# EAGLE design ICSP_Pogo_Connector (EAGLE 6.4)
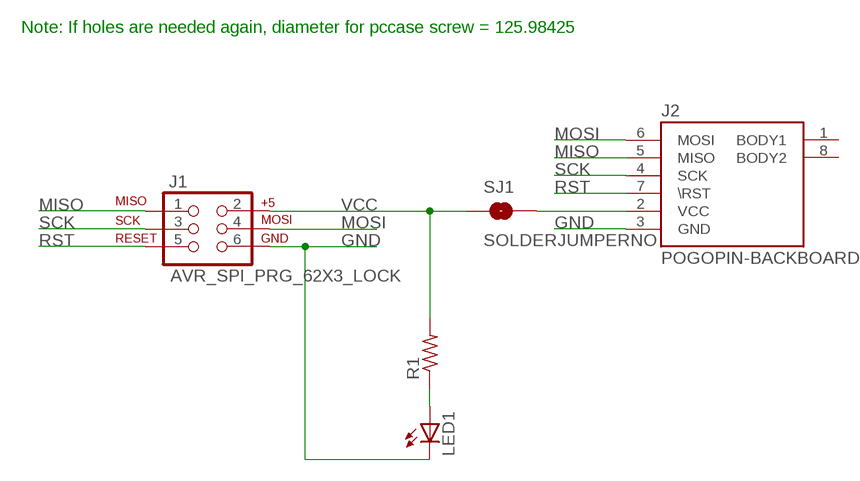
[diagram p0: schematic, sheet 1]

## Parts
J1  AVR_SPI_PRG_62X3_LOCK  [2X3_LOCK]
J2  POGOPIN-BACKBOARD  [POGOPROG-BACKMOUNT]
LED1  LED0603  [LED-0603]
R1  R-US_R0603  [R0603]
SJ1  SOLDERJUMPERNO  [SJ_2S-NO]

## Nets
GND [POWER]: J1.6 J2.3(GND) LED1.C
MISO: J1.1 J2.5(MISO)
MOSI: J1.4 J2.6(MOSI)
N$2: J2.2(VCC) SJ1.2
N$3: LED1.A R1.1
RST: J1.5 J2.7(\RST)
SCK: J1.3 J2.4(SCK)
VCC: J1.2 R1.2 SJ1.1
Unconnected: J2.1(BODY1) J2.8(BODY2)

## Notes on the sheet
- Note: If holes are needed again, diameter for pccase screw = 125.98425

## Library data of the parts
J1 = SparkFun:AVR_SPI_PRG_6: AVR ISP 6 Pin This is the reduced ISP connector for AVR programming. Common on Arduino. This footprint will take up less PCB space and can be used with a 10-pin to 6-pin adapter such as SKU: BOB-08508
J2 = Protofusion:POGOPIN-BACKBOARD
LED1 = SparkFun:LED: LEDs Standard schematic elements and footprints for 5mm, 3mm, 1206, and 0603 sized LEDs. 5mm - Spark Fun Electronics SKU : COM-00529 (and others)
R1 = adafruit:R-US_: RESISTOR, American symbol
SJ1 = SparkFun:SOLDERJUMPER: Solder Jumper Standard SMD solder jumper. Used to automate production. Two varients : Normally Open and Normally Closed are the same, but have different paste layers. NC will have a large amount of paste and should jumper during reflow.

## Net classes
0 default: width 0.254 mm
1 POWER: width 0.406 mm

## Board
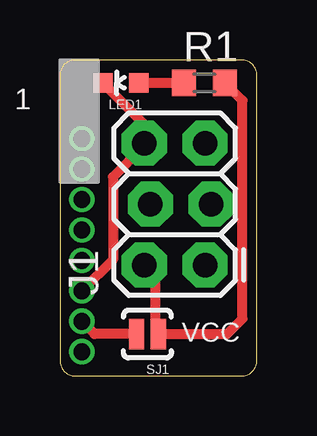
[diagram p1: board, top side]
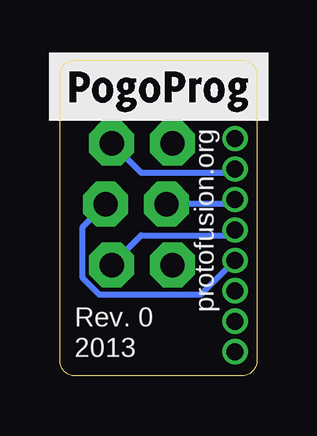
[diagram p2: board, bottom side, seen from below]

Size 8.22 x 13.18 mm. Coordinates in mm from the lower left corner, seen from the top.
Outline: 0,12.55 0,0.64 arc90 0.64,0 7.58,0 arc90 8.22,0.64 8.22,12.55 arc90 7.58,13.18 0.64,13.18 arc90 0,12.55
Copper layers (1*16): Top 0.0356mm / dielectric 1.5011mm / Bottom 0.0356mm
Design rules "LaenPCBOrder": minimum track width 6mil, minimum drill 6mil, track to track 6mil, track to pad 6mil, pad to pad 6mil, via to via 6mil, smd to smd 6mil, copper to edge 15mil, drill to drill 6mil, minimum pad ring 7mil, minimum via ring 7mil, stop-mask expansion 4mil, vias tented up to drill 12mil, thermal gap 10mil

### Footprints (pad centres in the part's own frame; a part is rotated, then mirrored left to right if it is on the bottom)
2X3_LOCK = drill 1.016 pad 1.88 octagon: 1 0,0; 2 0,2.54; 3 2.54,-0.254; 4 2.54,2.286; 5 5.08,0; 6 5.08,2.54
POGOPROG-BACKMOUNT = drill 0.7: 1 0,8.941; 2 0,7.671; 3 0,6.401; 4 0,5.131; 5 0,3.861; 6 0,2.591; 7 0,1.321; 8 0,0.051
LED-0603 = smd 0.8 x 0.8: A 0,-0.75; C 0,0.75
R0603 = smd 1 x 1.1: 1 -0.85,0; 2 0.85,0
SJ_2S-NO = smd 0.635 x 1.27: 1 -0.45,0; 2 0.45,0

### Placement (x,y rotation side)
J1  6.06,4.63 90 top
J2  0.91,9.95 180 top
LED1  2.54,12.22 90 top
R1  6.03,12.22 0 top
SJ1  3.65,1.75 180 top
U$2  [POGOPROG_LOGO]  8.66,10.66 0 bottom

### Tracks (layer width: path | path; a pad name or v marks a point on that pad's centre or on a via)
GND
  Top 0.406: LED1.C 1.8,12.21 3.5,10.51 3.5,9.72 J1.6 3.43,9.52 2.21,8.3 2.21,4.85 J2.3
MISO
  Bottom 0.254: J2.5 1.14,5.86 4.83,5.86 6.04,4.64 J1.1
MOSI
  Bottom 0.254: J2.6 1.09,7.18 3.76,7.18 J1.4
N$2
  Top 0.406: SJ1.2 1.45,1.75 J2.2
N$3
  Top 0.406: LED1.A R1.1
RST
  Bottom 0.254: J2.7 1.07,8.48 4.83,8.48 6.04,9.7 J1.5
SCK
  Bottom 0.254: J2.4 2.34,3.4 6.58,3.4 7.29,4.11 7.29,6.19 6.33,7.16 J1.3
VCC
  Top 0.254: 3.53,4.62 J1.2 | 3.99,2.08 SJ1.1
  Top 0.406: SJ1.1 6.99,1.75 7.62,2.38 7.62,11.49 R1.2 | 3.53,4.62 3.99,4.15 3.99,2.08

### Text on the board
tPlace: 1 | VCC
bPlace: protofusion.org | Rev. 0 | 2013